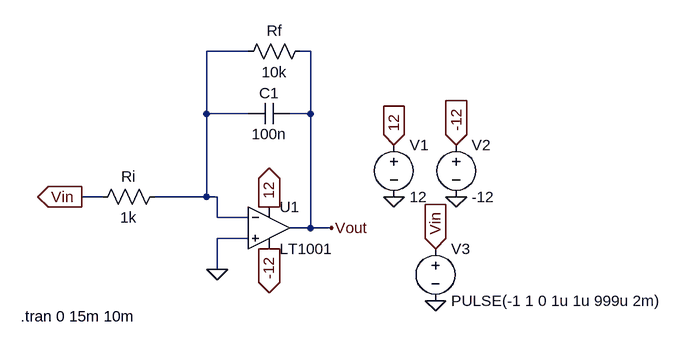
[diagram p0: schematic Draft2.asc]
Draft2.asc, the LTspice schematic file:
Version 4
SHEET 1 880 680
WIRE -48 -160 -112 -160
WIRE 48 -160 32 -160
WIRE -112 -64 -112 -160
WIRE -48 -64 -112 -64
WIRE 48 -64 48 -160
WIRE 48 -64 16 -64
WIRE -272 64 -304 64
WIRE -112 64 -112 -64
WIRE -112 64 -192 64
WIRE -96 64 -112 64
WIRE -96 96 -96 64
WIRE -48 96 -96 96
WIRE 48 112 48 -64
WIRE 48 112 16 112
WIRE 80 112 48 112
WIRE -48 128 -96 128
WIRE -96 176 -96 128
FLAG 176 64 0
FLAG 272 64 0
FLAG 176 -16 12
IOPIN 176 -16 In
FLAG -16 80 12
IOPIN -16 80 Out
FLAG 272 -16 -12
IOPIN 272 -16 In
FLAG -16 144 -12
IOPIN -16 144 Out
FLAG 240 144 Vin
IOPIN 240 144 In
FLAG -304 64 Vin
IOPIN -304 64 Out
FLAG 240 224 0
FLAG 80 112 Vout
FLAG -96 176 0
SYMBOL Opamps\\LT1001 -16 48 R0
SYMATTR InstName U1
SYMBOL voltage 176 -32 R0
SYMATTR InstName V1
SYMATTR Value 12
SYMBOL voltage 272 -32 R0
SYMATTR InstName V2
SYMATTR Value -12
SYMBOL res -176 48 R90
WINDOW 0 0 56 VBottom 2
WINDOW 3 32 56 VTop 2
SYMATTR InstName Ri
SYMATTR Value 1k
SYMBOL voltage 240 128 R0
WINDOW 123 0 0 Left 0
WINDOW 39 0 0 Left 0
SYMATTR InstName V3
SYMATTR Value PULSE(-1 1 0 1u 1u 999u 2m)
SYMBOL cap 16 -80 R90
WINDOW 0 0 32 VBottom 2
WINDOW 3 32 32 VTop 2
SYMATTR InstName C1
SYMATTR Value 100n
SYMBOL res 48 -176 R90
WINDOW 0 0 56 VBottom 2
WINDOW 3 32 56 VTop 2
SYMATTR InstName Rf
SYMATTR Value 10k
TEXT -398 248 Left 2 !.tran 0 15m 10m

The netlist it stands for:
* Draft2.asc
XU1 0 N001 12 -12 Vout LT1001  ; pins In+ In- V+ V- OUT
V1 12 0 12
V2 -12 0 -12
Ri N001 Vin 1k
V3 Vin 0 PULSE(-1 1 0 1u 1u 999u 2m)
C1 Vout N001 100n
Rf Vout N001 10k
.tran 0 15m 10m
.lib LTC.lib
.backanno
.end